# Altium project PCB_Project_v2.PrjPCB
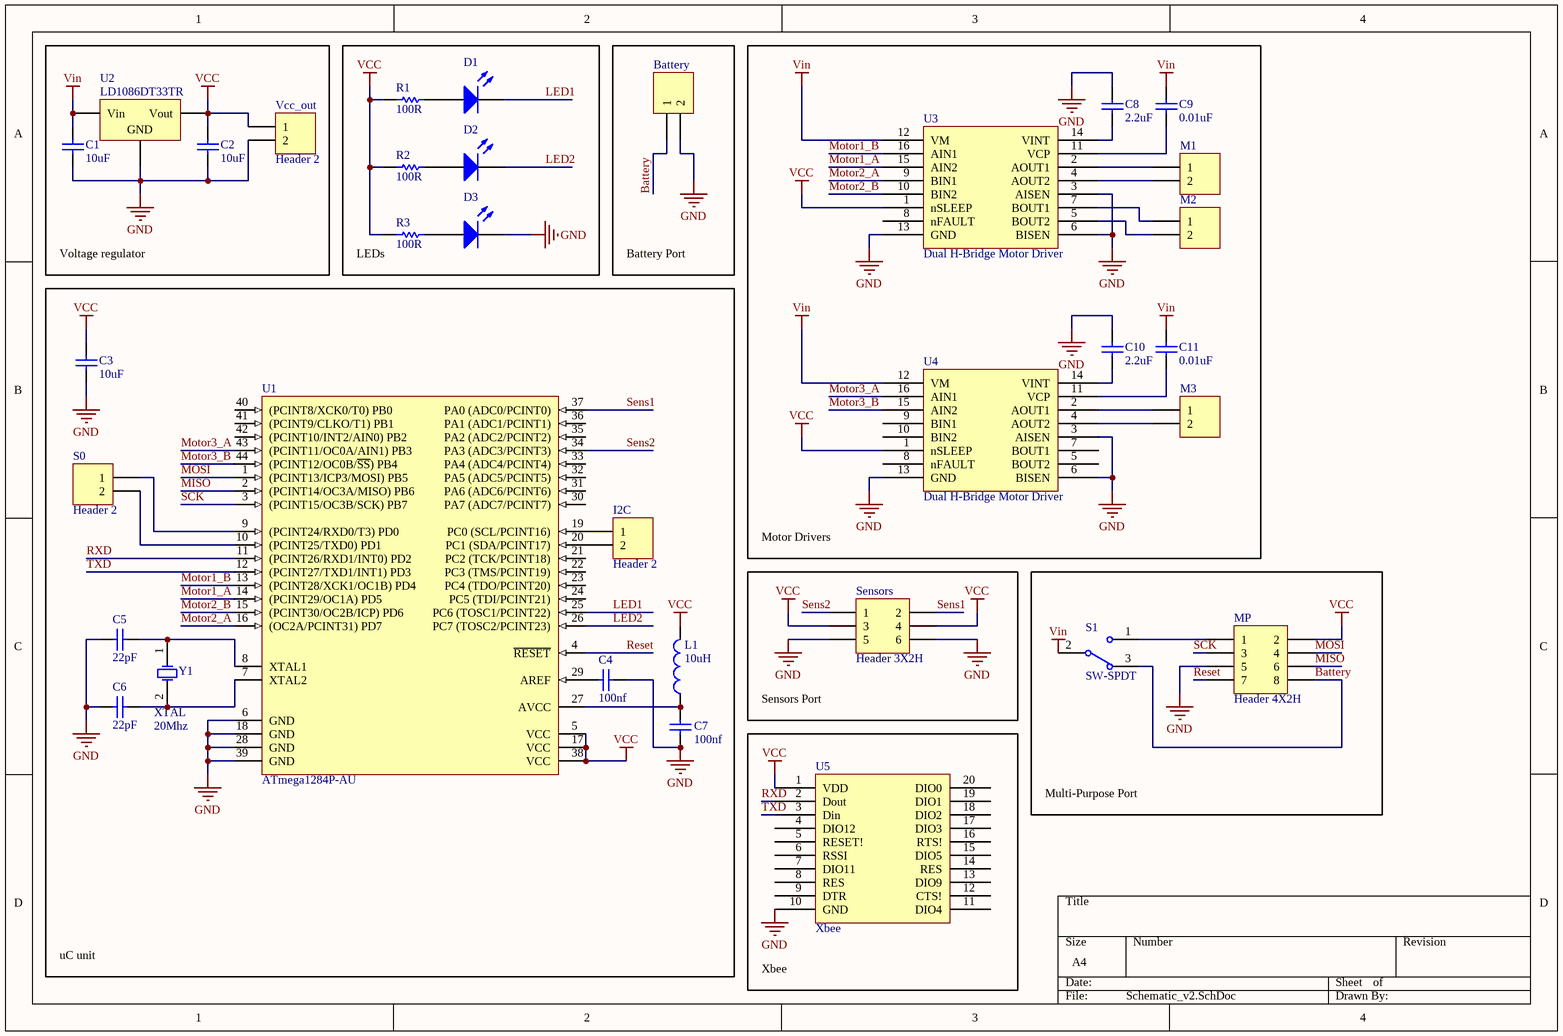
[diagram p0: Schematic_v2.SchDoc]
1 sheet, 34 parts. Net scope: global (net labels, ports and power ports of the same name join across sheets).
Board file: PCB.PcbDoc

## Sheet Schematic_v2.SchDoc
size A4

### Parts
Battery  Header 2  [Terminal_2_p3.5]  (value not drawn)
C1  value 10uF  [C1206]  (hidden comment: Cap)
C2  value 10uF  [C1206]  (hidden comment: Cap)
C3  value 10uF  [C1206]  (hidden comment: Cap)
C4  value 100nf  [C1206]  (hidden comment: Cap)
C5  value 22pF  [C1206]  (hidden comment: Cap)
C6  value 22pF  [C1206]  (hidden comment: Cap)
C7  value 100nf  [C1206]  (hidden comment: Cap)
C8  value 2.2uF  [C1206]  (hidden comment: Cap)
C9  value 0.01uF  [C1206]  (hidden comment: Cap)
C10  value 2.2uF  [C1206]  (hidden comment: Cap)
C11  value 0.01uF  [C1206]  (hidden comment: Cap)
D1  LED0  [1206]  (value not drawn)
D2  LED0  [1206]  (value not drawn)
D3  LED0  [1206]  (value not drawn)
I2C  Header 2  [HDR1X2]
L1  value 10uH  [C1206]  (hidden comment: Inductor)
M1  Header 2  [Terminal_2_p3.5]  (value not drawn)
M2  Header 2  [Terminal_2_p3.5]  (value not drawn)
M3  Header 2  [Terminal_2_p3.5]  (value not drawn)
MP  Header 4X2H  [HDR2X4H]
R1  value 100R  [8-1206]  (hidden comment: Res1)
R2  value 100R  [8-1206]  (hidden comment: Res1)
R3  value 100R  [8-1206]  (hidden comment: Res1)
S0  Header 2  [HDR1X2]
S1  SW-SPDT  [Switch_SPDT]
Sensors  Header 3X2H  [HDR2X3H]
U1  ATmega1284P-AU  [44A_N]
U2  LD1086DT33TR  [TO-252AA_M]
U3  Dual H-Bridge Motor Driver  [TSSOP16_M]
U4  Dual H-Bridge Motor Driver  [TSSOP16_M]
U5  Xbee  [Xbee_DIP]
Vcc_out  Header 2  [HDR1X2]
Y1  XTAL  Frequency: 20Mhz  [ECX-64A]

### Blocks framed on the sheet
Voltage regulator: C1 C2 U2 Vcc_out
LEDs: D1-D3 R1-R3
Battery Port: Battery
Motor Drivers: C8-C11 M1-M3 U3 U4
uC unit: C3-C7 I2C L1 S0 U1 Y1
Sensors Port: Sensors
Multi-Purpose Port: MP S1
Xbee: U5

### Nets
GND: Battery.2 C1.1 C2.1 C3.1 C4.2 C5.1 C6.1 C7.1 C8.2 C10.2 D3.2(K) MP.5 Sensors.5 Sensors.6 U1.6(GND) U1.18(GND) U1.28(GND) U1.39(GND) U2.2(GND) U3.3(AISEN) U3.6(BISEN) U3.13(GND) U4.3(AISEN) U4.6(BISEN) U4.13(GND) U5.10(GND) Vcc_out.2
VCC: C2.2 C3.2 L1.2 MP.2 R1.1 R2.1 R3.1 Sensors.3 Sensors.4 U1.5(VCC) U1.17(VCC) U1.38(VCC) U2.3(Vout) U3.1(nSLEEP) U4.1(nSLEEP) U5.1(VDD) Vcc_out.1
Vin: C1.2 C9.2 C11.2 S1.2 U2.1(Vin) U3.12(VM) U4.12(VM)
Battery: Battery.1 MP.8 S1.3
LED1: D1.2(K) U1.25(PC6_(TOSC1/PCINT22))
LED2: D2.2(K) U1.26(PC7_(TOSC2/PCINT23))
MISO: MP.6 U1.2((PCINT14/OC3A/MISO)_PB6)
MOSI: MP.4 U1.1((PCINT13/ICP3/MOSI)_PB5)
Motor1_A: U1.14((PCINT29/OC1A)_PD5) U3.15(AIN2)
Motor1_B: U1.13((PCINT28/XCK1/OC1B)_PD4) U3.16(AIN1)
Motor2_A: U1.16((OC2A/PCINT31)_PD7) U3.9(BIN1)
Motor2_B: U1.15((PCINT30/OC2B/ICP)_PD6) U3.10(BIN2)
Motor3_A: U1.43((PCINT11/OC0A/AIN1)_PB3) U4.16(AIN1)
Motor3_B: U1.44((PCINT12/OC0B/~{SS})_PB4) U4.15(AIN2)
Reset: MP.7 U1.4(~{RESET})
RXD: U1.11((PCINT26/RXD1/INT0)_PD2) U5.2(Dout)
SCK: MP.3 U1.3((PCINT15/OC3B/SCK)_PB7)
Sens1: Sensors.2 U1.37(PA0_(ADC0/PCINT0))
Sens2: Sensors.1 U1.34(PA3_(ADC3/PCINT3))
TXD: U1.12((PCINT27/TXD1/INT1)_PD3) U5.3(Din)
NetC4_1: C4.1 U1.29(AREF)
NetC5_2: C5.2 U1.8(XTAL1) Y1.1(OSC1)
NetC6_2: C6.2 U1.7(XTAL2) Y1.2(OSC2)
NetC7_2: C7.2 L1.1 U1.27(AVCC)
NetC8_1: C8.1 U3.14(VINT)
NetC9_1: C9.1 U3.11(VCP)
NetC10_1: C10.1 U4.14(VINT)
NetC11_1: C11.1 U4.11(VCP)
NetD1_1: D1.1(A) R1.2
NetD2_1: D2.1(A) R2.2
NetD3_1: D3.1(A) R3.2
NetI2C_1: I2C.1 U1.19(PC0_(SCL/PCINT16))
NetI2C_2: I2C.2 U1.20(PC1_(SDA/PCINT17))
NetM1_1: M1.1 U3.2(AOUT1)
NetM1_2: M1.2 U3.4(AOUT2)
NetM2_1: M2.1 U3.7(BOUT1)
NetM2_2: M2.2 U3.5(BOUT2)
NetM3_1: M3.1 U4.2(AOUT1)
NetM3_2: M3.2 U4.4(AOUT2)
NetMP_1: MP.1 S1.1
NetS0_1: S0.1 U1.9((PCINT24/RXD0/T3)_PD0)
NetS0_2: S0.2 U1.10((PCINT25/TXD0)_PD1)

Not connected (* = marked no-connect by the designer): U1 21(PC2_(TCK/PCINT18)) 22(PC3_(TMS/PCINT19)) 23(PC4_(TDO/PCINT20)) 24(PC5_(TDI/PCINT21)) 30(PA7_(ADC7/PCINT7)) 31(PA6_(ADC6/PCINT6)) 32(PA5_(ADC5/PCINT5)) 33(PA4_(ADC4/PCINT4)) 35(PA2_(ADC2/PCINT2)) 36(PA1_(ADC1/PCINT1)) 40((PCINT8/XCK0/T0)_PB0) 41((PCINT9/CLKO/T1)_PB1) 42((PCINT10/INT2/AIN0)_PB2); U3 8(nFAULT); U4 5(BOUT2) 7(BOUT1) 8(nFAULT) 9(BIN1) 10(BIN2); U5 4(DIO12) 5(RESET!) 6(RSSI) 7(DIO11) 8(RES) 9(DTR) 11(DIO4) 12(CTS!) 13(DIO9) 14(RES) 15(DIO5) 16(RTS!) 17(DIO3) 18(DIO2) 19(DIO1) 20(DIO0)

### Library data of the parts
Battery I2C M1-M3 S0 Vcc_out = Header 2: Header, 2-Pin; LatestRevisionDate: 17-Jul-2002; LatestRevisionNote: Re-released for DXP Platform.; Publisher: Altium Limited
C1-C11 = Cap: Capacitor; Published: 8-Jun-2000; LatestRevisionDate: 17-Jul-2002; LatestRevisionNote: Re-released for DXP Platform.; PackageReference: RAD-0.3; Publisher: Altium Limited; PackageDescription: Radial Cap, Thru-Hole; 2 Leads; 0.3 in Pin Spacing
D1-D3 = LED0: Typical INFRARED GaAs LED; Published: 8-Jun-2000; LatestRevisionDate: 08-Jul-2005; LatestRevisionNote: Mech Layer 1 removed.; PackageReference: LED-0; Publisher: Altium Limited; PackageDescription: LED; 2 Leads
L1 = Inductor: Code_IEC: 1005; Published: 8-Jun-2000; LatestRevisionDate: 29-May-2009; LatestRevisionNote: IPC-7351 Footprint Added.; PackageReference: 0402-A; Publisher: Altium Limited; PackageDescription: Chip Inductor; Code_JEITA: 0402
MP = Header 4X2H: Header, 4-Pin, Dual row, Right Angle; LatestRevisionDate: 17-Jul-2002; LatestRevisionNote: Re-released for DXP Platform.; Publisher: Altium Limited
R1-R3 = Res1: Resistor; Published: 8-Jun-2000; LatestRevisionDate: 17-Jul-2002; LatestRevisionNote: Re-released for DXP Platform.; PackageReference: AXIAL-0.3; Publisher: Altium Limited; PackageDescription: Axial Device, Thru-Hole; 2 Leads; 0.3 in Pin Spacing
S1 = SW-SPDT: SPDT Subminiature Toggle Switch, Right Angle Mounting, Vertical Actuation; Published: 24-Mar-1999; LatestRevisionDate: 17-Dec-2003; LatestRevisionNote: Schematic revised, PCB Footprint replaced.; DatasheetVersion: 05-Dec-2000; PackageReference: TL36WW15050; Publisher: Altium Limited; PackageDescription: Switch; 4 Leads; ComponentLink1Description: Manufacturer Link; ComponentLink1URL: http://www.apem.com
Sensors = Header 3X2H: Header, 3-Pin, Dual row, Right Angle; LatestRevisionDate: 17-Jul-2002; LatestRevisionNote: Re-released for DXP Platform.; Publisher: Altium Limited
U1 = ATmega1284P-AU: 20 MHz 8-bit AVR Microcontroller with 128KB Flash, 44-Pin TQFP Pkg, Industrial Temp; Published: 20-Sep-2010; DatasheetVersion: revD, Nov-2009; PackageVersion: rev.B, Oct-2001; PackageReference: 44A; Publisher: Altium Limited; PackageDescription: 44-Pin Plastic Thin Profile Quad Flat Pack, 10 x 10 x 1.0 mm Body, 0.8 mm Pitch (TQFP); Supplier 1: Digi-Key; Supplier Part Number 1: ATMEGA1284P-AU-ND; Supplier 2: Farnell; Supplier Part Number 2: 1715480; Supplier 3: Mouser; Supplier Part Number 3: 556-ATMEGA1284P-AU; ComponentLink1Description: ATmega1284P Datasheet; ComponentLink1URL: http://www.atmel.com/dyn/resources/prod_documents/doc8059.pdf; ComponentLink2Description: Atmel.com Home; ComponentLink2URL: http://www.atmel.com
U2 = Volt Reg: Voltage Regulator; pin to pad: 1>3 2>1 3>4; Published: 24-Mar-1999; LatestRevisionDate: 29-May-2009; LatestRevisionNote: IPC-7351 Footprint Added.; PackageReference: D2PAK; Publisher: Altium Limited; PackageDescription: 3-Pin Transistor Outline Package 2.54 mm Pitch, 15.1 mm Lead Span
U3 U4 = DRV8833
Y1 = XTAL: Crystal; Published: 8-Jun-2000; LatestRevisionDate: 17-Jul-2002; LatestRevisionNote: Re-released for DXP Platform.; PackageReference: R38; Publisher: Altium Limited; PackageDescription: Crystal, Thru-Hole; 2 Leads; Body 3.1 x 8.2 mm (Dia.xH)